# Altium schematic sheet Part G.SchDoc
size A4; SheetNumber: 14; SheetTotal: 16
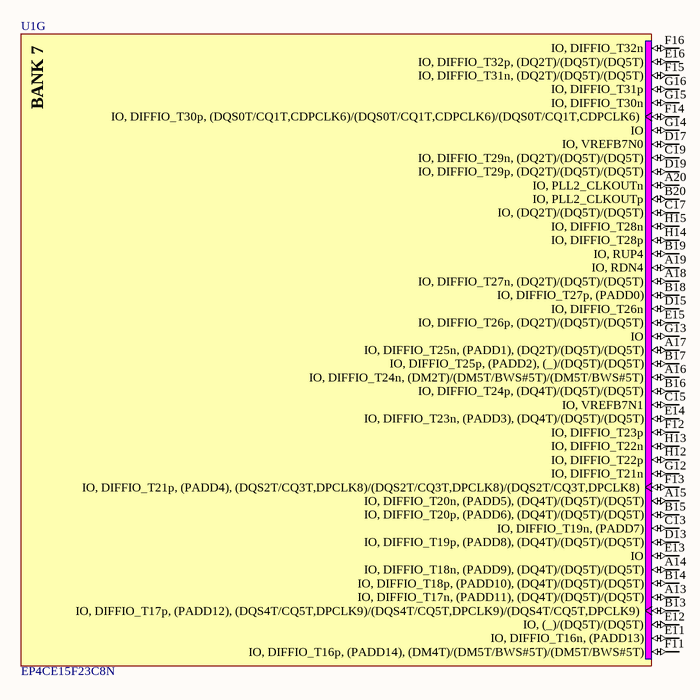
[diagram p0: Part G.SchDoc]

## Parts
U1  EP4CE15F23C8N  [FBGA484_A-240]  (part G of 13)

## Nets

Not connected (* = marked no-connect by the designer): U1 A13(IO,_DIFFIO_T17n,_(PADD11),_(DQ4T)/(DQ5T)/(DQ5T)) A14(IO,_DIFFIO_T18n,_(PADD9),_(DQ4T)/(DQ5T)/(DQ5T)) A15(IO,_DIFFIO_T20n,_(PADD5),_(DQ4T)/(DQ5T)/(DQ5T)) A16(IO,_DIFFIO_T24n,_(DM2T)/(DM5T/BWS#5T)/(DM5T/BWS#5T)) A17(IO,_DIFFIO_T25n,_(PADD1),_(DQ2T)/(DQ5T)/(DQ5T)) A18(IO,_DIFFIO_T27n,_(DQ2T)/(DQ5T)/(DQ5T)) A19(IO,_RDN4) A20(IO,_PLL2_CLKOUTn) B13(IO,_DIFFIO_T17p,_(PADD12),_(DQS4T/CQ5T,DPCLK9)/(DQS4T/CQ5T,DPCLK9)/(DQS4T/CQ5T,DPCLK9)) B14(IO,_DIFFIO_T18p,_(PADD10),_(DQ4T)/(DQ5T)/(DQ5T)) B15(IO,_DIFFIO_T20p,_(PADD6),_(DQ4T)/(DQ5T)/(DQ5T)) B16(IO,_DIFFIO_T24p,_(DQ4T)/(DQ5T)/(DQ5T)) B17(IO,_DIFFIO_T25p,_(PADD2),_(_)/(DQ5T)/(DQ5T)) B18(IO,_DIFFIO_T27p,_(PADD0)) B19(IO,_RUP4) B20(IO,_PLL2_CLKOUTp) C13(IO,_DIFFIO_T19n,_(PADD7)) C15(IO,_VREFB7N1) C17(IO,_(DQ2T)/(DQ5T)/(DQ5T)) C19(IO,_DIFFIO_T29n,_(DQ2T)/(DQ5T)/(DQ5T)) D13(IO,_DIFFIO_T19p,_(PADD8),_(DQ4T)/(DQ5T)/(DQ5T)) D15(IO,_DIFFIO_T26n) D17(IO,_VREFB7N0) D19(IO,_DIFFIO_T29p,_(DQ2T)/(DQ5T)/(DQ5T)) E11(IO,_DIFFIO_T16n,_(PADD13)) E12(IO,_(_)/(DQ5T)/(DQ5T)) E13(IO) E14(IO,_DIFFIO_T23n,_(PADD3),_(DQ4T)/(DQ5T)/(DQ5T)) E15(IO,_DIFFIO_T26p,_(DQ2T)/(DQ5T)/(DQ5T)) E16(IO,_DIFFIO_T32p,_(DQ2T)/(DQ5T)/(DQ5T)) F11(IO,_DIFFIO_T16p,_(PADD14),_(DM4T)/(DM5T/BWS#5T)/(DM5T/BWS#5T)) F12(IO,_DIFFIO_T23p) F13(IO,_DIFFIO_T21p,_(PADD4),_(DQS2T/CQ3T,DPCLK8)/(DQS2T/CQ3T,DPCLK8)/(DQS2T/CQ3T,DPCLK8)) F14(IO,_DIFFIO_T30p,_(DQS0T/CQ1T,CDPCLK6)/(DQS0T/CQ1T,CDPCLK6)/(DQS0T/CQ1T,CDPCLK6)) F15(IO,_DIFFIO_T31n,_(DQ2T)/(DQ5T)/(DQ5T)) F16(IO,_DIFFIO_T32n) G12(IO,_DIFFIO_T21n) G13(IO) G14(IO) G15(IO,_DIFFIO_T30n) G16(IO,_DIFFIO_T31p) H12(IO,_DIFFIO_T22p) H13(IO,_DIFFIO_T22n) H14(IO,_DIFFIO_T28p) H15(IO,_DIFFIO_T28n)

## Notes on the sheet
- (in symbol FPGA_EP4CE15F23C8N, part G) BANK 7

## Library data of the parts
U1 = FPGA_EP4CE15F23C8N: Cyclone IV Family FPGA, 1.2V Core, 343 I/O Pins, 4 PLLs, 484-Pin FBGA, Speed Grade 8, Commercial Grade, Pb-Free; Manufacturer: Altera; PackageVersion: ver1.0, Jun-2011; PackageReference: FBGA484_A-240; ComponentLink3URL: http://www.altera.com/literature/lit-dp.jsp?category=cyc%204&showspreadsheet=y; ComponentLink1Description: Manufacturer URL; DatasheetVersion: ver1.6, Nov-2011; ComponentLink3Description: Pinout; ComponentLink2URL: http://www.altera.com/literature/hb/cyclone-iv/cyclone4-handbook.pdf; ComponentLink1URL: http://www.altera.com/; ComponentLink2Description: Handbook; PackageDescription: 484-Pin FineLine Ball Grid Array (FBGA) - Wire Bond - A:2.40; Code_JEDEC: MS-034-AAJ-1; ComponentLink4URL: http://www.altera.com/devicepackaging/04R00247-02.pdf; ComponentLink4Description: Package Specification